# EAGLE design 6ButtonTHT (EAGLE 9.6.2)
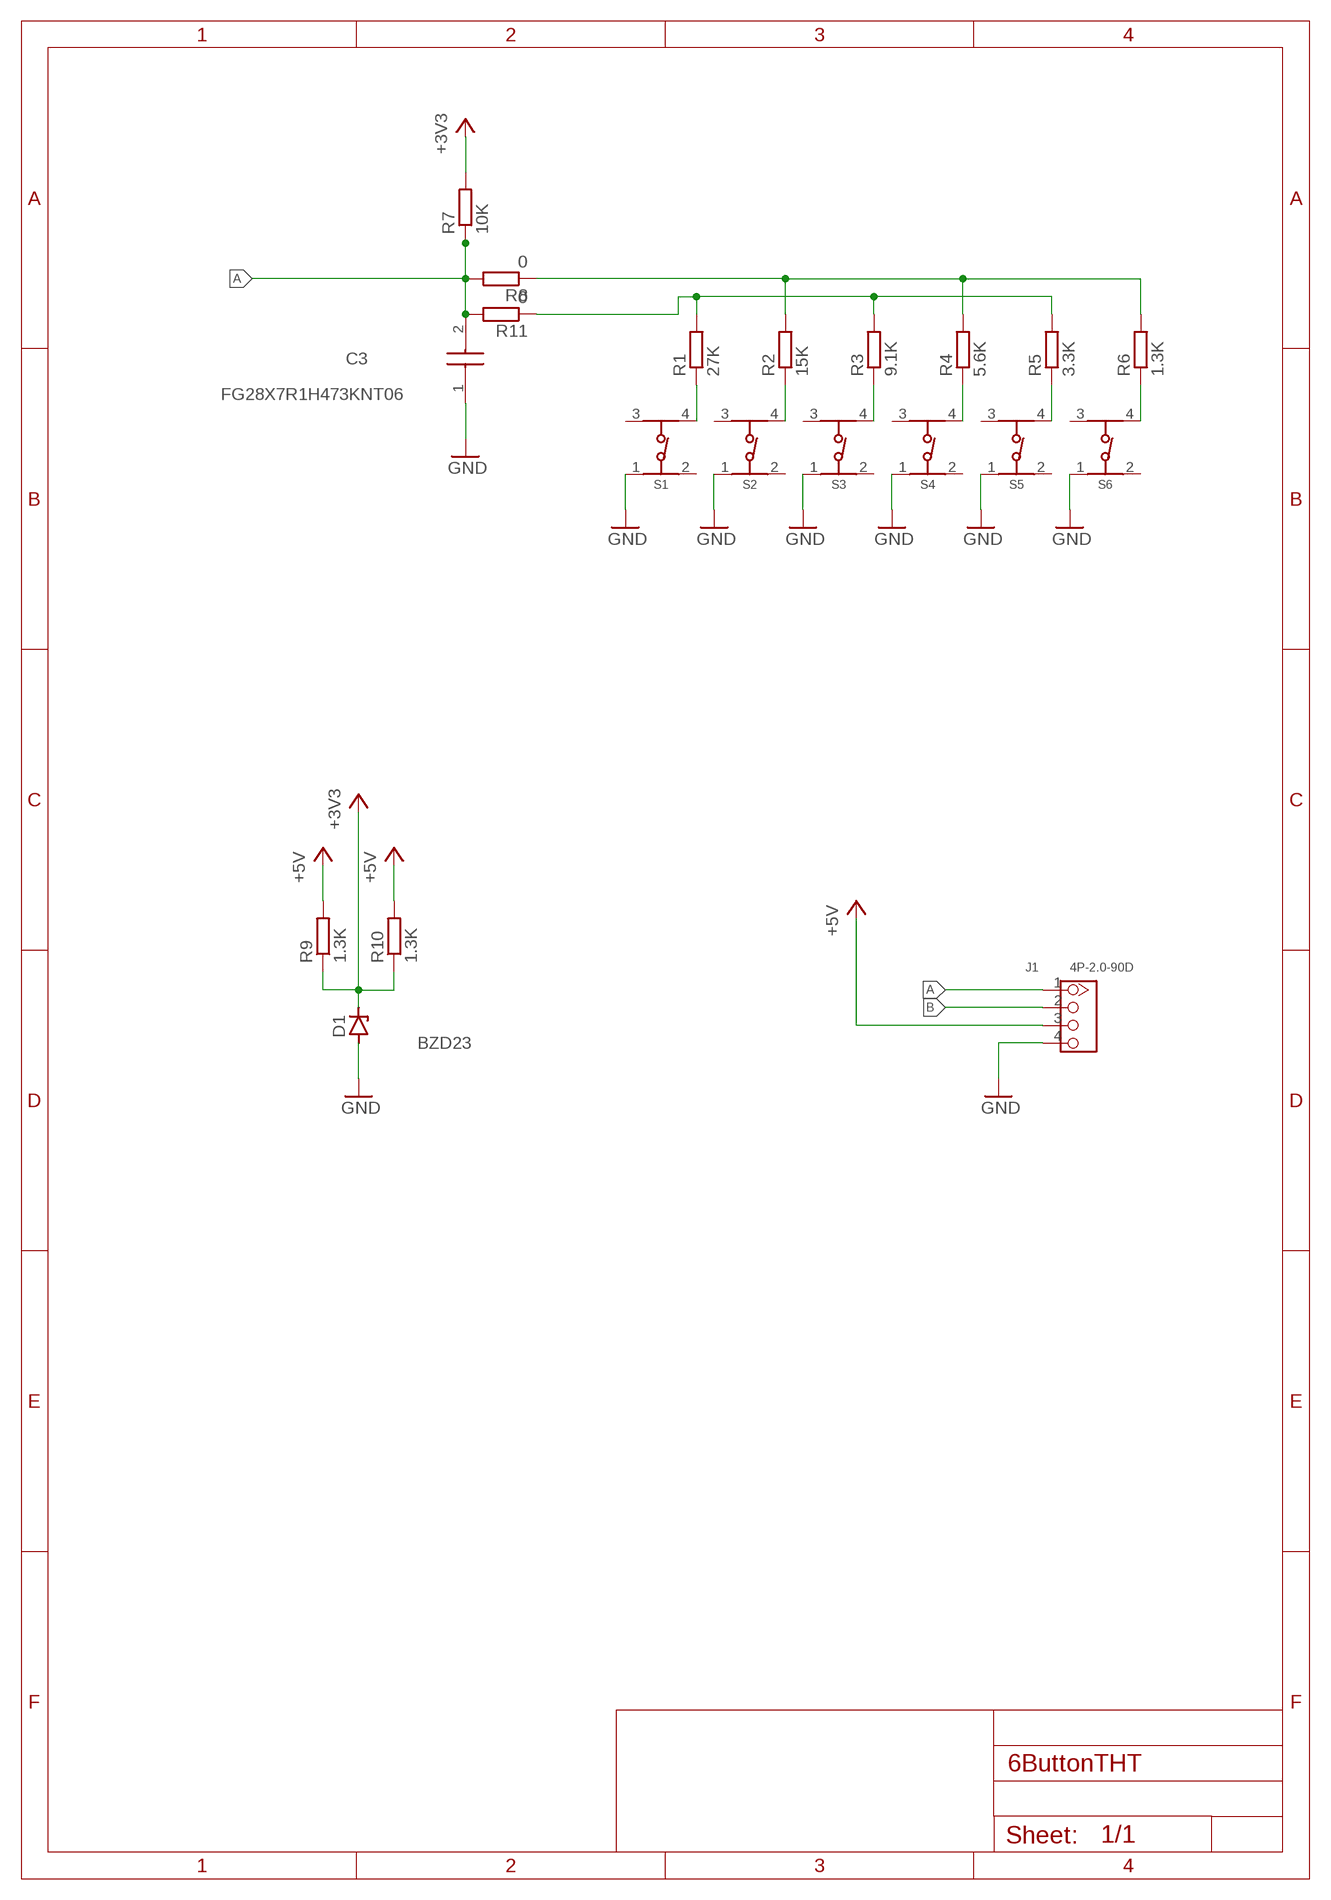
[diagram p0: schematic, sheet 1]

## Parts
C3  FG28X7R1H473KNT06  [FG28]
D1  BZD23  [SOD81]
J1  4P-2.0-90D  GROVE-CONNECTOR-DIP-90D(4P-2.0)  [HW4-2.0-90D]
R1  27K  R-EU_0207/10  [0207/10]
R2  15K  R-EU_0207/10  [0207/10]
R3  9.1K  R-EU_0207/10  [0207/10]
R4  5.6K  R-EU_0207/10  [0207/10]
R5  3.3K  R-EU_0207/10  [0207/10]
R6  1.3K  R-EU_0207/10  [0207/10]
R7  10K  R-EU_0207/10  [0207/10]
R8  0  R-EU_0207/10  [0207/10]
R9  1.3K  R-EU_0207/10  [0207/10]
R10  1.3K  R-EU_0207/10  [0207/10]
R11  0  R-EU_0207/10  [0207/10]
S1  430466073726  [4304X60737X6]
S2  430466073726  [4304X60737X6]
S3  430466073726  [4304X60737X6]
S4  430466073726  [4304X60737X6]
S5  430466073726  [4304X60737X6]
S6  430466073726  [4304X60737X6]

## Nets
+3V3: D1.C R7.2 R9.1 R10.1
+5V: J1.3 R9.2 R10.2
A: C3.2 J1.1 R7.1 R8.2 R11.2
B: J1.2
GND: C3.1 D1.A J1.4 S1.1 S2.1 S3.1 S4.1 S5.1 S6.1
N$1: R1.1 S1.4
N$2: R2.1 S2.4
N$3: R3.1 S3.4
N$4: R4.1 S4.4
N$5: R5.1 S5.4
N$6: R6.1 S6.4
N$27: R2.2 R4.2 R6.2 R8.1
N$30: R1.2 R3.2 R5.2 R11.1
Unconnected: S1.2 S1.3 S2.2 S2.3 S3.2 S3.3 S4.2 S4.3 S5.2 S5.3 S6.2 S6.3

## Library data of the parts
C3 = FG28X7R1H473KNT06-pcb-part-libraries:FG28X7R1H473KNT06: MLCC with dipped radial lead Source: Datasheet <https://componentsearchengine.com/Datasheets/1/FG28X7R1H473KNT06.pdf>; DESCRIPTION: MLCC with dipped radial lead; HEIGHT: 5.5mm; MANUFACTURER_NAME: TDK; MANUFACTURER_PART_NUMBER: FG28X7R1H473KNT06; MOUSER_PART_NUMBER: 810-FG28X7R1H473KNT6; MOUSER_PRICE-STOCK: https://www.mouser.com/Search/Refine.aspx?Keyword=810-FG28X7R1H473KNT6
D1 = diode:BZD23: Z DIODE
J1 = OPL_Connector:GROVE-CONNECTOR-DIP-90D(4P-2.0): 320110034
R1-R11 = rcl:R-EU_: RESISTOR, European symbol; SPICEPREFIX: R
S1-S6 = Wurth_Switch_WS-TATV:430466073726: WS-TATV THT Washable Tact Switch 12x12 mm Material Properties Cover Material : Stainless Steel Properties Actuator Material:LCP Actuator Flammability Rating:UL94 V-0 Actuator Color:Black; Salmon; White Frame Material:PPA Frame Flammability Rating:UL94 HB Frame Color:Black Contact Material:Stainless Steel Contact Plating:Silver Terminal Material:Copper Alloy Terminal Plating:Silver VR:12 V (DC) Contact Resistance Initial:100 mΩ Contact Resistance After Life Test:2 Ω RISO:100 MΩ Withstanding Voltage:250 V (AC) Washable:Yes Qty.:50 Mechanical Properties Electrical Life:200000 Times; 300000 Times; 500000 Times Stroke :0.3 mm General Information Operating Temperature:-40 up to +85 °C Washable:Yes <https://www.we-online.com/catalog/media/o61120v209%20Family_WS_TSW_THT_4304x60xx7x6_pf2.jpg> Details see: https://www.we-online.com/catalog/en/TATV_12X12_THT_WASHABLE_4304x60xx7x6/ Updated by yingchun,Shan;2020-02-21 2020(C) Würth Elektronik; DATASHEET-URL: https://www.we-online.com/catalog/datasheet/430466073726.pdf; H: 7.3mm; OPERATION-FORCE: 260g; PART-NUMBER: 430466073726; QTY: 50

## Board
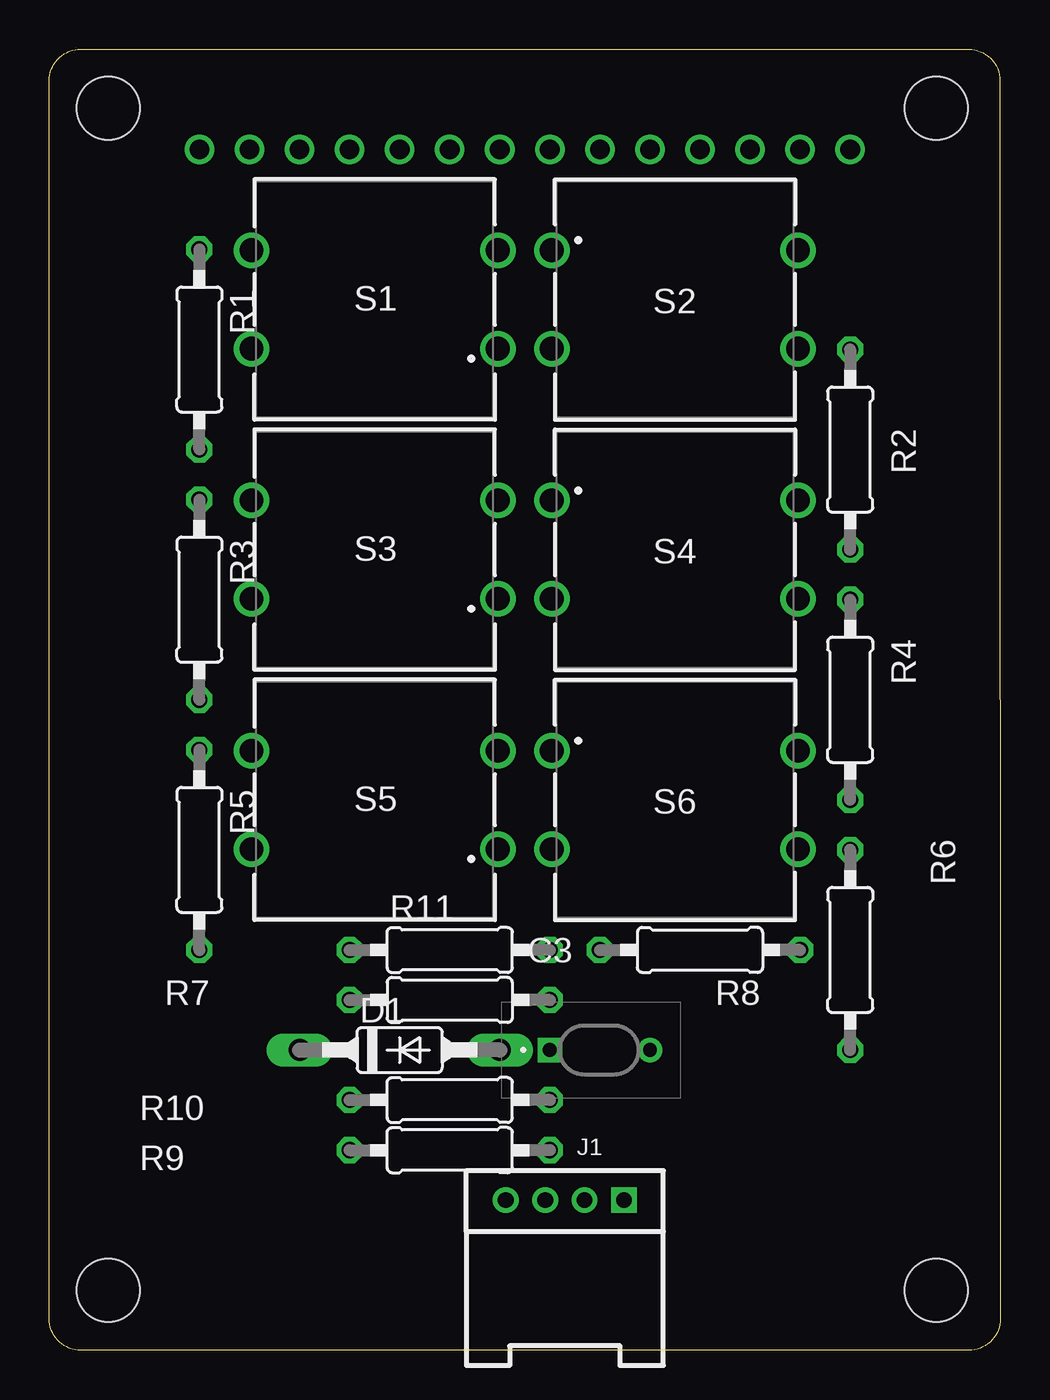
[diagram p1: board, top side]
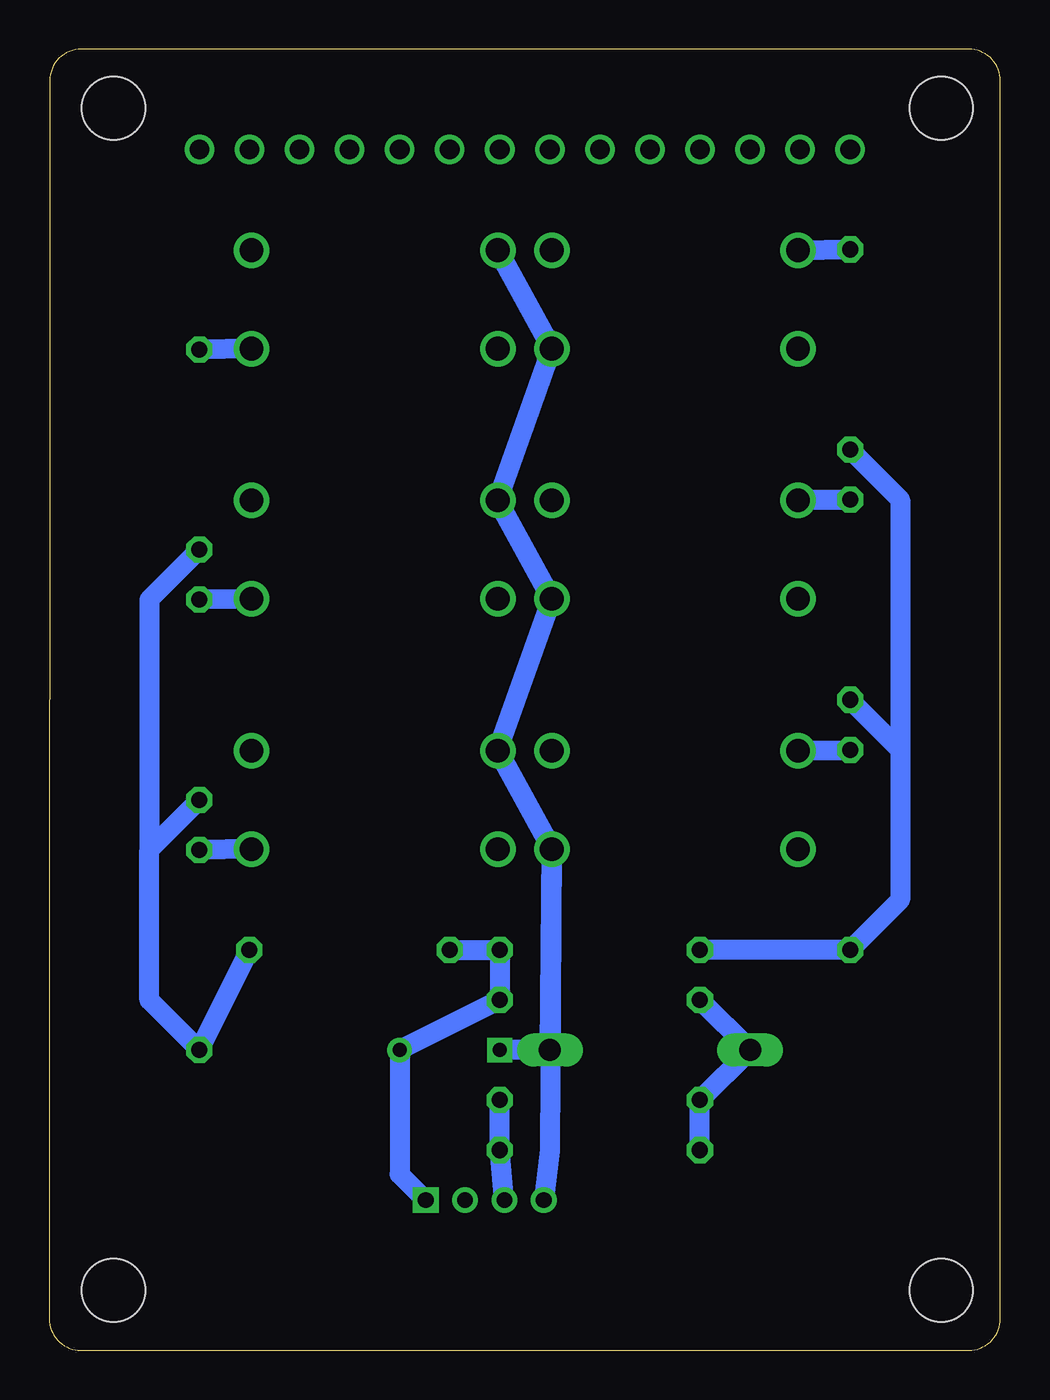
[diagram p2: board, bottom side, seen from below]

Size 48.26 x 66.04 mm. Coordinates in mm from the lower left corner, seen from the top.
Outline: 0,1.6 0,64.44 arc-90 1.6,66.04 46.64,66.04 arc-90 48.24,64.44 48.26,1.6 arc-90 46.66,0 1.6,0 arc-90 0,1.6
Copper layers (1*16): Top 0.035mm / dielectric 1.5mm / Bottom 0.035mm
Design rules "default": minimum track width 6mil, minimum drill 0.35mm, track to track 6mil, track to pad 6mil, pad to pad 6mil, via to via 6mil, smd to smd 6mil, copper to edge 40mil, drill to drill 6mil, minimum pad ring 10mil, minimum via ring 8mil, stop-mask expansion 4mil, vias tented up to drill 0mil, thermal gap 10mil
Holes 3.2 mm at 3,63.04 45,63.04 45,3.04 3,3.04

### Footprints (pad centres in the part's own frame; a part is rotated, then mirrored left to right if it is on the bottom)
FG28 = drill 0.7 pad 1.25 square: 1 0,0 | drill 0.7 pad 1.25: 2 5.08,0
SOD81 = drill 1.118 long: A 5.08,0; C -5.08,0
HW4-2.0-90D = drill 0.8 pad 1.27 square: 1 -3,0 | drill 0.8 pad 1.27: 2 -1,0; 3 1,0; 4 3,0
0207/10 = drill 0.813 octagon: 1 -5.08,0; 2 5.08,0
4304X60737X6 = drill 1.2: 1 -6.25,2.5; 2 6.25,2.5; 3 -6.25,-2.5; 4 6.25,-2.5

### Placement (x,y rotation side)
C3  25.4,15.24 0 top
D1  17.78,15.24 0 top
J1  26.16,7.62 180 top
R1  7.62,50.8 270 top
R2  40.64,45.72 270 top
R3  7.62,38.1 270 top
R4  40.64,33.02 270 top
R5  7.62,25.4 270 top
R6  40.64,20.32 270 top
R7  20.32,17.78 180 top
R8  33.02,20.32 180 top
R9  20.32,10.16 0 top
R10  20.32,12.7 0 top
R11  20.32,20.32 0 top
S1  16.51,53.34 180 top
S2  31.75,53.34 0 top
S3  16.51,40.64 180 top
S4  31.75,40.64 0 top
S5  16.51,27.94 180 top
S6  31.75,27.94 0 top

### Tracks (layer width: path | path; a pad name or v marks a point on that pad's centre or on a via)
+3V3
  Bottom 1.016: R9.1 R10.1 D1.C R7.2
+5V
  Bottom 1.016: J1.3 R9.2 R10.2
A
  Bottom 1.016: R8.2 R11.2 R7.1 C3.2 30.48,8.94 J1.1
GND
  Bottom 1.016: S2.1 S1.1 | S1.1 | S1.1 S4.1 S3.1 S6.1 S5.1 | S5.1 22.86,10.16 J1.4 | S5.1 D1.A C3.1
N$1
  Bottom 1.016: S1.4 R1.1
N$2
  Bottom 1.016: S2.4 R2.1
N$3
  Bottom 1.016: S3.4 10.22,43.18 R3.1
N$4
  Bottom 1.016: S4.4 R4.1
N$5
  Bottom 1.016: S5.4 R5.1
N$6
  Bottom 1.016: S6.4 R6.1
N$11  (via drill 1)
  other vias: 7.62,60.96
N$12  (via drill 1)
  other vias: 10.16,60.96
N$13  (via drill 1)
  other vias: 12.7,60.96
N$14  (via drill 1)
  other vias: 15.24,60.96
N$15  (via drill 1)
  other vias: 17.78,60.96
N$16  (via drill 1)
  other vias: 20.32,60.96
N$17  (via drill 1)
  other vias: 22.86,60.96
N$18  (via drill 1)
  other vias: 25.4,60.96
N$19  (via drill 1)
  other vias: 27.94,60.96
N$20  (via drill 1)
  other vias: 30.48,60.96
N$21  (via drill 1)
  other vias: 33.02,60.96
N$22  (via drill 1)
  other vias: 35.56,60.96
N$23  (via drill 1)
  other vias: 38.1,60.96
N$24  (via drill 1)
  other vias: 40.64,60.96
N$27
  Bottom 1.016: 43.18,25.4 43.18,38.1 R2.2 | R4.2 43.18,25.4 | 43.18,25.4 43.18,17.78 R6.2 R8.1
N$30
  Bottom 1.016: 5.08,30.48 5.08,43.18 R1.2 | 5.08,30.48 5.08,22.86 R5.2 R11.1 | R3.2 5.08,30.48